# EAGLE design V2 (EAGLE 9.6.2)
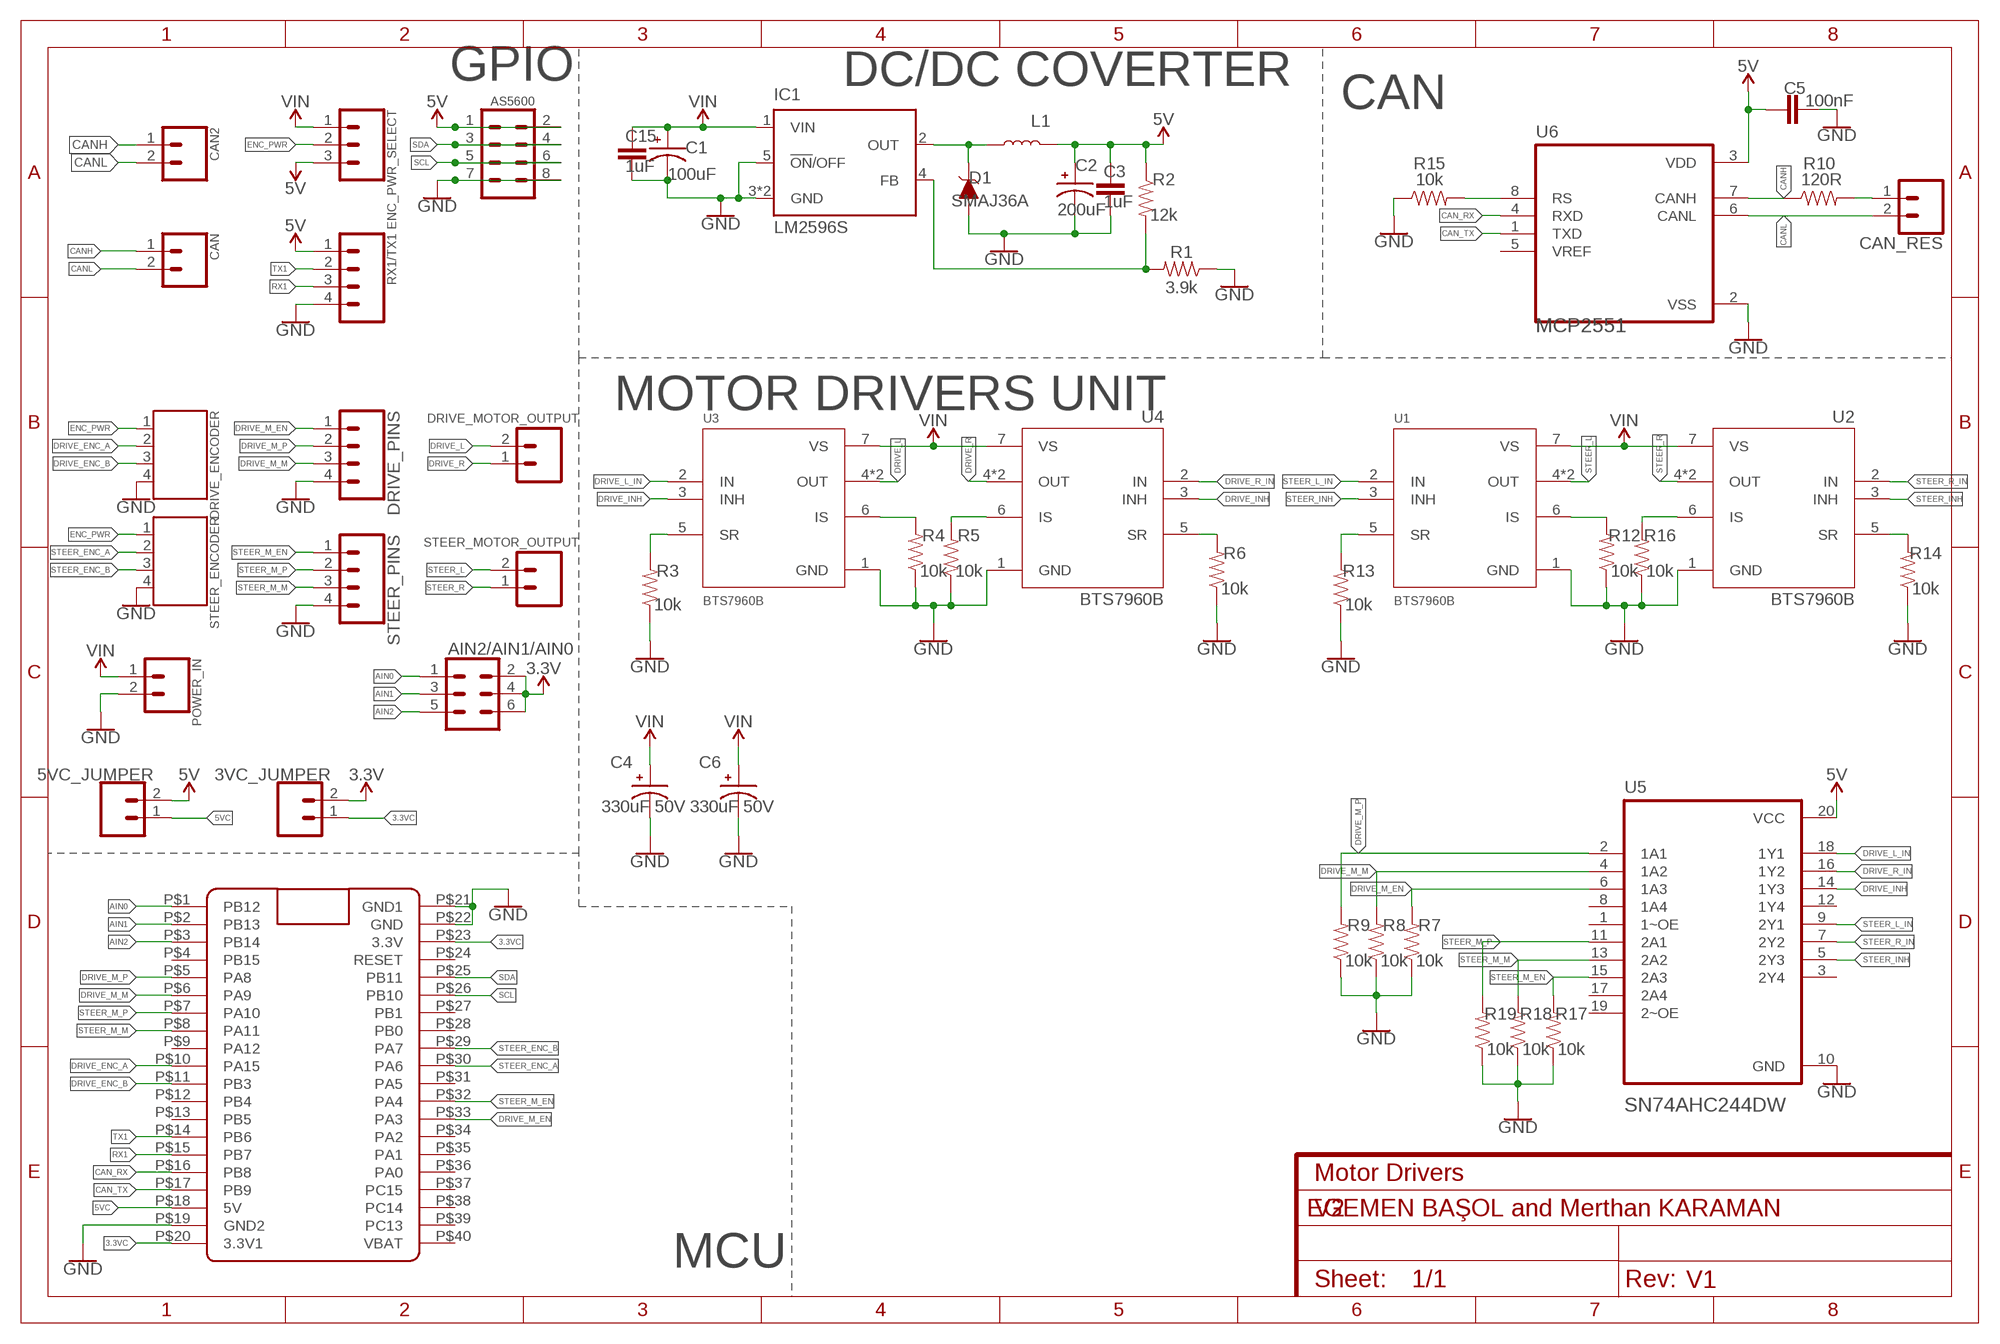
[diagram p0: schematic, sheet 1]
FRAME1 (FRAME-A4L): CNAME: Motor Drivers; CREVISION: V1; DESIGNER: EGEMEN BAŞOL and Merthan KARAMAN; REV: V2

## Parts
3VC_JUMPER  CONN_02  [1X02]
5VC_JUMPER  CONN_02  [1X02]
AIN2/AIN1/AIN0  CONN_03X2FEMALE  [2X3]
AS5600  5V/SCL/SDA/GND  CONN_04X2  [2X4]
C1  100uF  CPOL-SMD  [CPOL-SMD]
C2  200uF  CPOL-SMD  [CPOL-SMD]
C3  1uF  0.18UF-0603-10V-10%  [0603]
C4  330uF 50V  CPOL-RADIAL-5MM-10MM  [CPOL-RADIAL-5MM-10MM]
C5  100nF  CAP-0805  [0805]
C6  330uF 50V  CPOL-RADIAL-5MM-10MM  [CPOL-RADIAL-5MM-10MM]
C15  1uF  2.2UF-0805-25V-(+80/-20%)  [0805]
CAN  CANH/CANL  5.08MM_2PIN  [5.08MM_2PIN]
CAN2  CANH/CANL  5.08MM_2PIN  [5.08MM_2PIN]
CAN_RES  CONN_02  [1X02]
D1  SMAJ36A  DIODE_TVS_UNI  [DO-214AC]
DRIVE_ENCODER  GND/B/A/PWR  5.08MM_4PIN  [5.08MM_4PIN]
DRIVE_MOTOR_OUTPUT  5.08MM_2PIN  [5.08MM_2PIN]
DRIVE_PINS  EN/ PWM_P/ PWM_M/ GND  CONN_04  [1X04]
ENC_PWR_SELECT  VIN/PWR/5V  CONN_03  [1X03]
IC1  LM2596S  [TO263-5]
L1  47uH  COIL  [COIL_14X14]
POWER_IN  VIN/GND  5.08MM_2PIN  [5.08MM_2PIN]
R1  3.9k  RESISTOR0805  [0805]
R2  12k  RESISTOR0805  [0805]
R3  10k  RESISTOR0805  [0805]
R4  10k  RESISTOR0805  [0805]
R5  10k  RESISTOR0805  [0805]
R6  10k  RESISTOR0805  [0805]
R7  10k  RESISTOR0805  [0805]
R8  10k  RESISTOR0805  [0805]
R9  10k  RESISTOR0805  [0805]
R10  120R  RESISTOR0805  [0805]
R12  10k  RESISTOR0805  [0805]
R13  10k  RESISTOR0805  [0805]
R14  10k  RESISTOR0805  [0805]
R15  10k  RESISTOR0805  [0805]
R16  10k  RESISTOR0805  [0805]
R17  10k  RESISTOR0805  [0805]
R18  10k  RESISTOR0805  [0805]
R19  10k  RESISTOR0805  [0805]
RX1/TX1  GND/RX1/TX1/5V  CONN_04  [1X04]
STEER_ENCODER  PWR/A/B/GND  5.08MM_4PIN  [5.08MM_4PIN]
STEER_MOTOR_OUTPUT  5.08MM_2PIN  [5.08MM_2PIN]
STEER_PINS  EN/ PWM_P/ PWM_M/ GND  CONN_04  [1X04]
U1  BTS7960B  [DPAK127P1490X440-8N]
U2  BTS7960B  [DPAK127P1490X440-8N]
U3  BTS7960B  [DPAK127P1490X440-8N]
U4  BTS7960B  [DPAK127P1490X440-8N]
U5  SN74AHC244DW  [SOIC127P1030X265-20N]
U6  MCP2551  [DIP-8]
U$1  BLUE_PILL  [BLUE_PILL]

## Nets
3.3V: 3VC_JUMPER.2 AIN2/AIN1/AIN0.2 AIN2/AIN1/AIN0.4 AIN2/AIN1/AIN0.6
3.3VC: 3VC_JUMPER.1 U$1.P$20(3.3V1) U$1.P$23(3.3V)
5V: 5VC_JUMPER.2 AS5600.1 AS5600.2 C2.1 C3.2 C5.2 ENC_PWR_SELECT.3 L1.P$2 R2.1 RX1/TX1.1 U5.20(VCC) U6.3(VDD)
5VC: 5VC_JUMPER.1 U$1.P$18(5V)
AIN0: AIN2/AIN1/AIN0.1 U$1.P$1(PB12)
AIN1: AIN2/AIN1/AIN0.3 U$1.P$2(PB13)
AIN2: AIN2/AIN1/AIN0.5 U$1.P$3(PB14)
CAN_RX: U6.4(RXD) U$1.P$16(PB8)
CAN_TX: U6.1(TXD) U$1.P$17(PB9)
CANH: CAN2.1 CAN.1 R10.1 U6.7(CANH)
CANL: CAN2.2 CAN.2 CAN_RES.2 U6.6(CANL)
DRIVE_ENC_A: DRIVE_ENCODER.2 U$1.P$10(PA15)
DRIVE_ENC_B: DRIVE_ENCODER.3 U$1.P$11(PB3)
DRIVE_INH: U3.3(INH) U4.3(INH) U5.14(1Y3)
DRIVE_L: DRIVE_MOTOR_OUTPUT.2 U3.4(OUT) U3.8(OUT)
DRIVE_L_IN: U3.2(IN) U5.18(1Y1)
DRIVE_M_EN: DRIVE_PINS.1 R7.2 U5.6(1A3) U$1.P$33(PA3)
DRIVE_M_M: DRIVE_PINS.3 R8.2 U5.4(1A2) U$1.P$6(PA9)
DRIVE_M_P: DRIVE_PINS.2 R9.2 U5.2(1A1) U$1.P$5(PA8)
DRIVE_R: DRIVE_MOTOR_OUTPUT.1 U4.4(OUT) U4.8(OUT)
DRIVE_R_IN: U4.2(IN) U5.16(1Y2)
ENC_PWR: DRIVE_ENCODER.1 ENC_PWR_SELECT.2 STEER_ENCODER.1
GND: AS5600.7 AS5600.8 C1.2 C2.2 C3.1 C4.N C5.1 C6.N C15.1 D1.A DRIVE_ENCODER.4 DRIVE_PINS.4 IC1.3(GND) IC1.5(!ON!/OFF) IC1.TAB(GND) POWER_IN.2 R1.1 R3.1 R4.1 R5.1 R6.1 R7.1 R8.1 R9.1 R12.1 R13.1 R14.1 R15.1 R16.1 R17.1 R18.1 R19.1 RX1/TX1.4 STEER_ENCODER.4 STEER_PINS.4 U1.1(GND) U2.1(GND) U3.1(GND) U4.1(GND) U5.10(GND) U6.2(VSS) U$1.P$19(GND2) U$1.P$21(GND1) U$1.P$22(GND)
N$1: D1.C IC1.2(OUT) L1.P$1
N$2: IC1.4(FB) R1.2 R2.2
N$3: R14.2 U2.5(SR)
N$4: R16.2 U2.6(IS)
N$5: CAN_RES.1 R10.2
N$6: R6.2 U4.5(SR)
N$7: R5.2 U4.6(IS)
N$8: R4.2 U3.6(IS)
N$9: R3.2 U3.5(SR)
N$11: R12.2 U1.6(IS)
N$12: R13.2 U1.5(SR)
N$13: R15.2 U6.8(RS)
RX1: RX1/TX1.3 U$1.P$15(PB7)
SCL: AS5600.5 AS5600.6 U$1.P$26(PB10)
SDA: AS5600.3 AS5600.4 U$1.P$25(PB11)
STEER_ENC_A: STEER_ENCODER.2 U$1.P$30(PA6)
STEER_ENC_B: STEER_ENCODER.3 U$1.P$29(PA7)
STEER_INH: U1.3(INH) U2.3(INH) U5.5(2Y3)
STEER_L: STEER_MOTOR_OUTPUT.2 U1.4(OUT) U1.8(OUT)
STEER_L_IN: U1.2(IN) U5.9(2Y1)
STEER_M_EN: R17.2 STEER_PINS.1 U5.15(2A3) U$1.P$32(PA4)
STEER_M_M: R18.2 STEER_PINS.3 U5.13(2A2) U$1.P$8(PA11)
STEER_M_P: R19.2 STEER_PINS.2 U5.11(2A1) U$1.P$7(PA10)
STEER_R: STEER_MOTOR_OUTPUT.1 U2.4(OUT) U2.8(OUT)
STEER_R_IN: U2.2(IN) U5.7(2Y2)
TX1: RX1/TX1.2 U$1.P$14(PB6)
VIN: C1.1 C4.P C6.P C15.2 ENC_PWR_SELECT.1 IC1.1(VIN) POWER_IN.1 U1.7(VS) U2.7(VS) U3.7(VS) U4.7(VS)
Unconnected: U5.1(1~OE) U5.3(2Y4) U5.8(1A4) U5.12(1Y4) U5.17(2A4) U5.19(2~OE) U6.5(VREF) U$1.P$4(PB15) U$1.P$9(PA12) U$1.P$12(PB4) U$1.P$13(PB5) U$1.P$24(RESET) U$1.P$27(PB1) U$1.P$28(PB0) U$1.P$31(PA5) U$1.P$34(PA2) U$1.P$35(PA1) U$1.P$36(PA0) U$1.P$37(PC15) U$1.P$38(PC14) U$1.P$39(PC13) U$1.P$40(VBAT)

## Notes on the sheet
- GPIO | DC/DC COVERTER
- CAN
- MOTOR DRIVERS UNIT
- MCU

## Library data of the parts
3VC_JUMPER 5VC_JUMPER CAN_RES = SparkFun-Connectors:CONN_02: Multi connection point. Often used as Generic Header-pin footprint for 0.1 inch spaced/style header connections On any of the 0.1 inch spaced packages, you can populate with these: Break Away Headers - Straight <https://www.sparkfun.com/products/116> (PRT-00116) Break Away Male Headers - Right Angle <https://www.sparkfun.com/products/553> (PRT-00553) Female Headers <https://www.sparkfun.com/products/115> (PRT-00115) Break Away Headers - Machine Pin <https://www.sparkfun.com/products/117> (PRT-00117) Break Away Female Headers - Swiss Machine Pin <https://www.sparkfun.com/products/743> (PRT-00743) For SCREWTERMINALS and SPRING TERMINALS visit here: Screw Terimnals on SparkFun.com <https://www.sparkfun.com/search/results?term=Screw+Terminals> (5mm/3.5mm/2.54mm spacing) This device is also useful as a general connection point to wire up your design to another part of your project. Our various solder wires solder well into these plated through hole pads. Hook-Up Wire - Assortment (Stranded, 22 AWG) <https://www.sparkfun.com/products/11375> (PRT-11375) Hook-Up Wire - Assortment (Solid Core, 22 AWG) <https://www.sparkfun.com/products/11367> (PRT-11367) View the entire wire category on our website here <https://www.sparkfun.com/categories/141> Special notes: Molex polarized connector foot print use with: PRT-08233 with associated crimp pins and housings. 2.54_SCREWTERM for use with PRT-10571. 3.5mm Screw Terminal footprints for PRT-08084 5mm Screw Terminal footprints for use with PRT-08432
AIN2/AIN1/AIN0 = SparkFun-Connectors:CONN_03X2: Multi connection point. Often used as Generic Header-pin footprint for 0.1 inch spaced/style header connections You can populate with any combo of single row headers, but if you'd like an exact match, check these: Header - 2x3 (Male, 0.1") <https://www.sparkfun.com/products/12807> (PRT-12807) Header - 2x3 (Female, 0.1") <https://www.sparkfun.com/products/13010> (PRT-13010) 2x3 Pin Shrouded Header <https://www.sparkfun.com/products/10877> (PRT-10877) On any of the 0.1 inch spaced packages, you can populate with these: Break Away Headers - Straight <https://www.sparkfun.com/products/116> (PRT-00116) Break Away Male Headers - Right Angle <https://www.sparkfun.com/products/553> (PRT-00553) Female Headers <https://www.sparkfun.com/products/115> (PRT-00115) Break Away Headers - Machine Pin <https://www.sparkfun.com/products/117> (PRT-00117) Break Away Female Headers - Swiss Machine Pin <https://www.sparkfun.com/products/743> (PRT-00743) Special note: the shrouded connector mates well with our 3x2 ribbon cables: Ribbon Crimp Connector - 6-pin (2x3, Female) <https://www.sparkfun.com/products/10651> (PRT-10651) Ribbon Cable - 6 wire (15ft) <https://www.sparkfun.com/products/10646> (PRT-10646); PROD_ID: CONN-11566; VALUE: FEMALE 2x3
AS5600 = SparkFun-Connectors:CONN_04X2: Multi connection point. Often used as Generic Header-pin footprint for 0.1 inch spaced/style header connections On any of the 0.1 inch spaced packages, you can populate with these: Break Away Headers - Straight <https://www.sparkfun.com/products/116> (PRT-00116) Break Away Male Headers - Right Angle <https://www.sparkfun.com/products/553> (PRT-00553) Female Headers <https://www.sparkfun.com/products/115> (PRT-00115) Break Away Headers - Machine Pin <https://www.sparkfun.com/products/117> (PRT-00117) Break Away Female Headers - Swiss Machine Pin <https://www.sparkfun.com/products/743> (PRT-00743)
C1 C2 = El_yapimi:CPOL-SMD: Check availability <https://pricing.snapeda.com/parts/EEEFN1H101L/Panasonic/view-part?ref=eda>; AVAILABILITY: In Stock; DESCRIPTION: CAP ALUM 100UF 20% 50V SMD; MF: Panasonic; MP: EEEFN1H101L; PACKAGE: RADIAL-2 Panasonic; PRICE: None; PURCHASE-URL: https://pricing.snapeda.com/search/part/EEEFN1H101L/?ref=eda
C3 = SparkFun-Capacitors:0.18UF: 0.18µF ceramic capacitor A capacitor is a passive two-terminal electrical component used to store electrical energy temporarily in an electric field.; PROD_ID: CAP-12380; VALUE: 0.18uF
C4 C6 = El_yapimi:CPOL-RADIAL-5MM-10MM: M-A Check availability <https://pricing.snapeda.com/parts/ECA2VM4R7/Panasonic/view-part?ref=eda>; AVAILABILITY: In Stock; DESCRIPTION: Aluminium Electrolytic Capacitor, Aec-Q200 M Series, 4.7 - F, - 20%, 350 V, 10 Mm; MF: Panasonic; MP: ECA2VM4R7; PACKAGE: RADIAL-2 Panasonic; PRICE: None; PURCHASE-URL: https://pricing.snapeda.com/search/part/ECA2VM4R7/?ref=eda
C5 = SparkFun-Capacitors:CAP
C15 = SparkFun-Capacitors:2.2UF: 2.2µF ceramic capacitors A capacitor is a passive two-terminal electrical component used to store electrical energy temporarily in an electric field.; PROD_ID: CAP-11624; VALUE: 2.2uF
CAN CAN2 DRIVE_MOTOR_OUTPUT POWER_IN STEER_MOTOR_OUTPUT = El_yapimi:5.08MM_2PIN
D1 = SparkFun-DiscreteSemi:DIODE_TVS_UNI; PROD_ID: DIO-15812
DRIVE_ENCODER STEER_ENCODER = El_yapimi:5.08MM_4PIN: Check availability <https://pricing.snapeda.com/parts/TB006-508-04BE/CUI%20Devices/view-part?ref=eda>; AVAILABILITY: In Stock; CUI_PURCHASE_URL: https://www.cuidevices.com/product/interconnect/connectors/terminal-blocks/tb006-508-series?utm_source=snapeda.com&utm_medium=referral&utm_campaign=snapedaBOM; DESCRIPTION: 2~24 Poles, Screw Type, Horizontal, 5.08 Pitch, 26~14 (AWG), Terminal Block Connector; MF: CUI Devices; MP: TB006-508-04BE; PACKAGE: None; PRICE: None; PURCHASE-URL: https://pricing.snapeda.com/search/part/TB006-508-04BE/?ref=eda
DRIVE_PINS RX1/TX1 STEER_PINS = SparkFun-Connectors:CONN_04: Multi connection point. Often used as Generic Header-pin footprint for 0.1 inch spaced/style header connections On any of the 0.1 inch spaced packages, you can populate with these: Break Away Headers - Straight <https://www.sparkfun.com/products/116> (PRT-00116) Break Away Male Headers - Right Angle <https://www.sparkfun.com/products/553> (PRT-00553) Female Headers <https://www.sparkfun.com/products/115> (PRT-00115) Break Away Headers - Machine Pin <https://www.sparkfun.com/products/117> (PRT-00117) Break Away Female Headers - Swiss Machine Pin <https://www.sparkfun.com/products/743> (PRT-00743) For SCREWTERMINALS and SPRING TERMINALS visit here: Screw Terimnals on SparkFun.com <https://www.sparkfun.com/search/results?term=Screw+Terminals> (5mm/3.5mm/2.54mm spacing) This device is also useful as a general connection point to wire up your design to another part of your project. Our various solder wires solder well into these plated through hole pads. Hook-Up Wire - Assortment (Stranded, 22 AWG) <https://www.sparkfun.com/products/11375> (PRT-11375) Hook-Up Wire - Assortment (Solid Core, 22 AWG) <https://www.sparkfun.com/products/11367> (PRT-11367) View the entire wire category on our website here <https://www.sparkfun.com/categories/141> Special notes: Molex polarized connector foot print use with SKU : PRT-08231 with associated crimp pins and housings. 1MM SMD Version SKU: PRT-10208; PROD_ID: CONN-09696
ENC_PWR_SELECT = SparkFun-Connectors:CONN_03: Multi connection point. Often used as Generic Header-pin footprint for 0.1 inch spaced/style header connections On any of the 0.1 inch spaced packages, you can populate with these: Break Away Headers - Straight <https://www.sparkfun.com/products/116> (PRT-00116) Break Away Male Headers - Right Angle <https://www.sparkfun.com/products/553> (PRT-00553) Female Headers <https://www.sparkfun.com/products/115> (PRT-00115) Break Away Headers - Machine Pin <https://www.sparkfun.com/products/117> (PRT-00117) Break Away Female Headers - Swiss Machine Pin <https://www.sparkfun.com/products/743> (PRT-00743) Stackable Header - 3 Pin (Female, 0.1") <https://www.sparkfun.com/products/13875> (PRT-13875) For SCREWTERMINALS and SPRING TERMINALS visit here: Screw Terimnals on SparkFun.com <https://www.sparkfun.com/search/results?term=Screw+Terminals> (5mm/3.5mm/2.54mm spacing) This device is also useful as a general connection point to wire up your design to another part of your project. Our various solder wires solder well into these plated through hole pads. Hook-Up Wire - Assortment (Stranded, 22 AWG) <https://www.sparkfun.com/products/11375> (PRT-11375) Hook-Up Wire - Assortment (Solid Core, 22 AWG) <https://www.sparkfun.com/products/11367> (PRT-11367) View the entire wire category on our website here <https://www.sparkfun.com/categories/141> Special notes: Molex polarized connector foot print use with SKU : PRT-08232 with associated crimp pins and housings.
IC1 = El_yapimi:LM2596S
L1 = El_yapimi:COIL
R1-R10 R12-R19 = SparkFun-Resistors:RESISTOR: Generic Resistor Package
U1-U4 = El_yapimi:BTS7960B: Half Bridge Motor Driver 7-Pin(6+Tab) TO-263 Check availability <https://pricing.snapeda.com/parts/BTS7960B/Infineon/view-part?ref=eda>
U5 = El_yapimi:SN74AHC244DW: Check availability <https://pricing.snapeda.com/parts/SN74AHC244DW/Texas%20Instruments/view-part?ref=eda>; AVAILABILITY: In Stock; DESCRIPTION: 8-ch, 2-V to 5.5-V buffers with 3-state outputs; MF: Texas Instruments; MP: SN74AHC244DW; PACKAGE: SOIC-20 Texas Instruments; PRICE: None; PURCHASE-URL: https://pricing.snapeda.com/search/part/SN74AHC244DW/?ref=eda
U6 = El_yapimi:MCP2551: Check availability <https://pricing.snapeda.com/parts/MCP2551-E/P/Microchip/view-part?ref=eda>; AVAILABILITY: In Stock; DESCRIPTION: 1/1 Transceiver Half CANbus 8-PDIP; MF: Microchip; MP: MCP2551-E/P; PACKAGE: DIP-8 Microchip; PRICE: None; PURCHASE-URL: https://pricing.snapeda.com/search/part/MCP2551-E/P/?ref=eda
U$1 = El_yapimi:BLUE_PILL

## Board
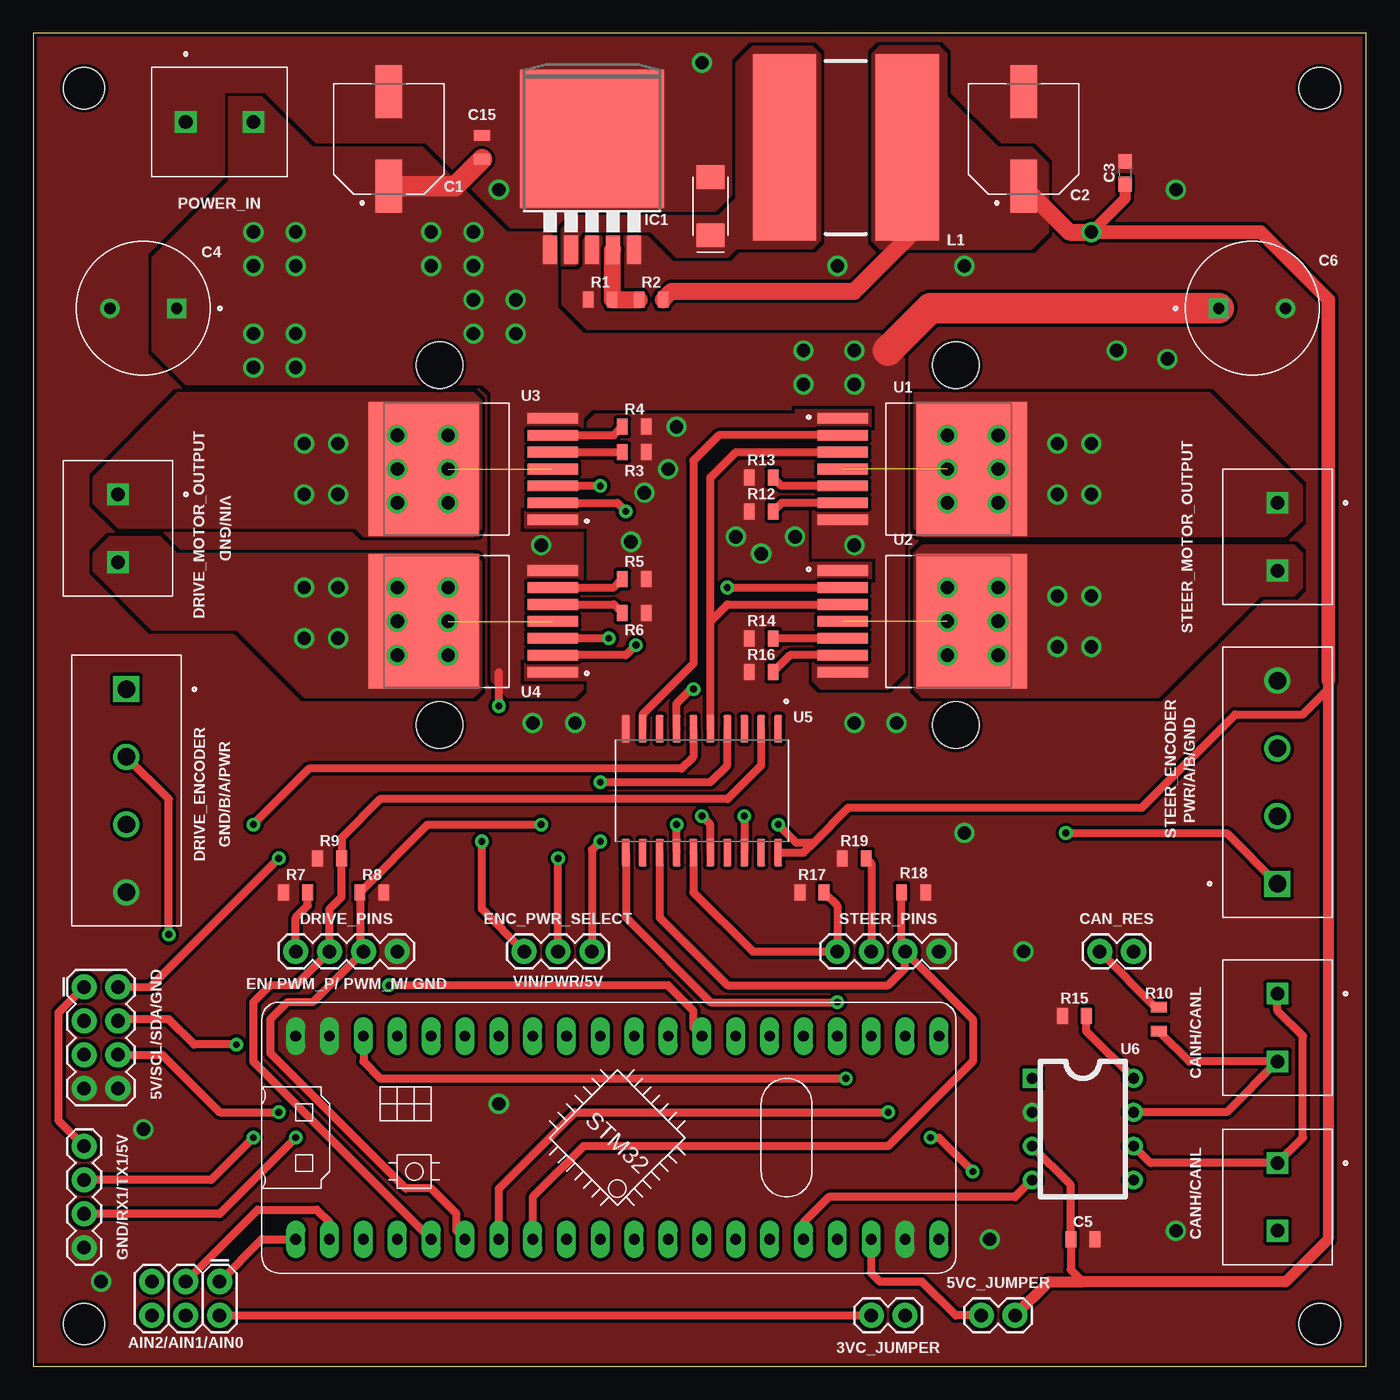
[diagram p1: board, top side]
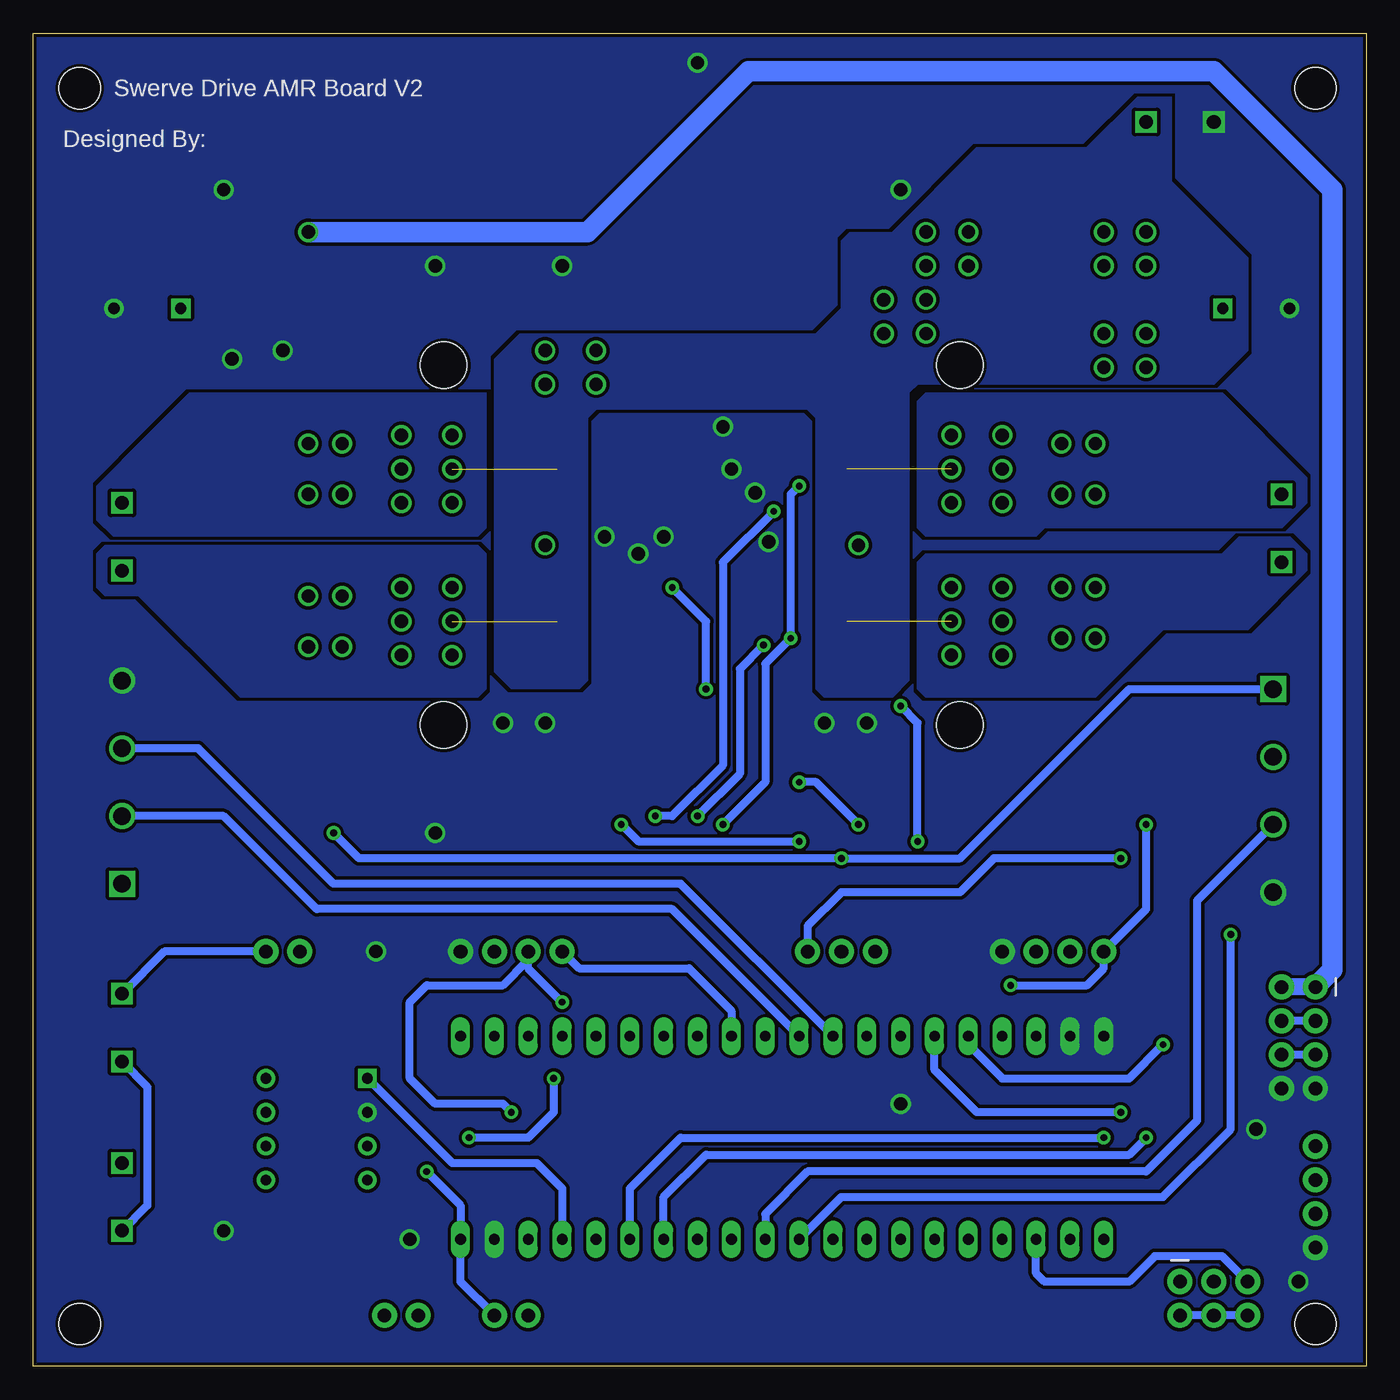
[diagram p2: board, bottom side, seen from below]

Size 100 x 100 mm. Coordinates in mm from the lower left corner, seen from the top.
Outline: 0,100 0,0 100,0 100,100 0,100
Copper layers (1*16): Top 0.035mm / dielectric 1.5mm / Bottom 0.035mm
Design rules "power_standarts *": minimum track width 8mil, minimum drill 20mil, track to track 10mil, track to pad 8mil, pad to pad 8mil, via to via 8mil, smd to smd 8mil, copper to edge 10mil, drill to drill 8mil, minimum pad ring 12mil, minimum via ring 10mil, stop-mask expansion 4mil, vias tented up to drill 25mil, thermal gap 10mil
Holes 3.1 mm at 3.81,95.89 96.52,95.89 96.52,3.17 3.81,3.17

### Footprints (pad centres in the part's own frame; a part is rotated, then mirrored left to right if it is on the bottom)
1X02 = drill 1.016 pad 1.88: 1 0,0; 2 2.54,0
2X3 = drill 1.016 pad 1.88: 1 0,0; 2 0,2.54; 3 2.54,0; 4 2.54,2.54; 5 5.08,0; 6 5.08,2.54
2X4 = drill 1.016 pad 1.88: 1 -3.81,-1.27; 2 -3.81,1.27; 3 -1.27,-1.27; 4 -1.27,1.27; 5 1.27,-1.27; 6 1.27,1.27; 7 3.81,-1.27; 8 3.81,1.27
CPOL-SMD = smd 4 x 2: 1 -3.55,0; 2 3.55,0
0603 = smd 1.1 x 1: 1 -0.85,0; 2 0.85,0
CPOL-RADIAL-5MM-10MM = drill 0.85 pad 1.2: N 2.5,0 | drill 0.85 pad 1.2 square: P -2.5,0
0805 = smd 0.8 x 1.2: 1 -0.9,0; 2 0.9,0
5.08MM_2PIN = drill 1.016 square: 1 5.08,0; 2 0,0
DO-214AC = smd 1.778 x 2.083: A 2.21,0; C -2.159,0
5.08MM_4PIN = drill 1.3 square: 1 0,0 | drill 1.3: 2 5.08,0; 3 10.16,0; 4 15.24,0
1X04 = drill 1.016 pad 1.88: 1 0,0; 2 2.54,0; 3 5.08,0; 4 7.62,0
1X03 = drill 1.016 pad 1.88: 1 0,0; 2 2.54,0; 3 5.08,0
TO263-5 = smd 1.067 x 2.159: 1 -3.15,-8.331; 2 -1.575,-8.331; 3 0,-8.331; 4 1.575,-8.331; 5 3.15,-8.331 | smd 10.8 x 10.41: TAB 0,0
COIL_14X14 = smd 14 x 4.75: P$1 0,4.6; P$2 0,-4.6
DPAK127P1490X440-8N = smd 3.81 x 0.8: 1 -5.95,3.81; 2 -5.95,2.54; 3 -5.95,1.27; 4 -5.95,0; 5 -5.95,-1.27; 6 -5.95,-2.54; 7 -5.95,-3.81 | smd 8.29 x 10.07: 8 3.71,0
SOIC127P1030X265-20N = smd 2.06 x 0.6: 1 -4.64,5.715; 2 -4.64,4.445; 3 -4.64,3.175; 4 -4.64,1.905; 5 -4.64,0.635; 6 -4.64,-0.635; 7 -4.64,-1.905; 8 -4.64,-3.175; 9 -4.64,-4.445; 10 -4.64,-5.715; 11 4.64,-5.715; 12 4.64,-4.445; 13 4.64,-3.175; 14 4.64,-1.905; 15 4.64,-0.635; 16 4.64,0.635; 17 4.64,1.905; 18 4.64,3.175; 19 4.64,4.445; 20 4.64,5.715
DIP-8 = drill 0.8 square: 1 -3.81,3.81 | drill 0.8: 2 -3.81,1.27; 3 -3.81,-1.27; 4 -3.81,-3.81; 5 3.81,-3.81; 6 3.81,-1.27; 7 3.81,1.27; 8 3.81,3.81
BLUE_PILL = drill 0.8 long: P$1 -7.62,15.24; P$2 -7.62,12.7; P$3 -7.62,10.16; P$4 -7.62,7.62; P$5 -7.62,5.08; P$6 -7.62,2.54; P$7 -7.62,0; P$8 -7.62,-2.54; P$9 -7.62,-5.08; P$10 -7.62,-7.62; P$11 -7.62,-10.16; P$12 -7.62,-12.7; P$13 -7.62,-15.24; P$14 -7.62,-17.78; P$15 -7.62,-20.32; P$16 -7.62,-22.86; P$17 -7.62,-25.4; P$18 -7.62,-27.94; P$19 -7.62,-30.48; P$20 -7.62,-33.02; P$21 7.62,15.24; P$22 7.62,12.7; P$23 7.62,10.16; P$24 7.62,7.62; P$25 7.62,5.08; P$26 7.62,2.54; P$27 7.62,0; P$28 7.62,-2.54; P$29 7.62,-5.08; P$30 7.62,-7.62; P$31 7.62,-10.16; P$32 7.62,-12.7; P$33 7.62,-15.24; P$34 7.62,-17.78; P$35 7.62,-20.32; P$36 7.62,-22.86; P$37 7.62,-25.4; P$38 7.62,-27.94; P$39 7.62,-30.48; P$40 7.62,-33.02
BTS_HEATER = hole 3.5: -13.5,0; 13.5,0

### Placement (x,y rotation side)
3VC_JUMPER  65.41,3.81 180 top
5VC_JUMPER  71.12,3.81 0 top
AIN2/AIN1/AIN0  13.97,6.35 180 top
AS5600  5.08,24.64 270 top
C1  26.67,92.08 90 top
C2  74.3,92.08 90 top
C3  81.92,89.53 270 top
C4  8.26,79.38 180 top
C5  78.74,9.53 180 top
C6  91.44,79.38 0 top
C15  33.66,91.44 270 top
CAN  93.34,27.94 270 top
CAN2  93.34,15.24 270 top
CAN_RES  80.01,31.11 0 top
D1  50.8,87 90 top
DRIVE_ENCODER  6.99,50.8 270 top
DRIVE_MOTOR_OUTPUT  6.35,65.41 270 top
DRIVE_PINS  19.68,31.11 0 top
ENC_PWR_SELECT  36.83,31.11 0 top
IC1  41.91,92.08 0 top
L1  60.96,91.44 90 top
POWER_IN  11.43,93.34 0 top
R1  42.55,80.01 0 top
R2  46.35,80.01 180 top
R3  45.09,68.58 180 top
R4  45.09,70.48 180 top
R5  45.09,59.05 180 top
R6  45.09,56.52 180 top
R7  19.68,35.56 0 top
R8  25.4,35.56 180 top
R9  22.23,38.1 0 top
R10  84.45,26.04 90 top
R12  54.61,64.14 0 top
R13  54.61,66.67 0 top
R14  54.61,54.61 0 top
R15  78.11,26.29 0 top
R16  54.61,52.07 0 top
R17  58.42,35.56 0 top
R18  66.04,35.56 180 top
R19  61.59,38.1 0 top
RX1/TX1  3.81,16.51 270 top
STEER_ENCODER  93.34,36.2 90 top
STEER_MOTOR_OUTPUT  93.34,64.77 270 top
STEER_PINS  60.33,31.11 0 top
U1  66.67,67.31 0 top
U2  66.67,55.88 0 top
U3  33.02,67.31 180 top
U4  33.02,55.88 180 top
U5  50.16,43.18 270 top
U6  78.74,17.78 0 top
U$1  34.92,17.14 90 top
U$2  [BTS_HEATER]  30.48,61.59 90 top
U$3  [BTS_HEATER]  69.22,61.59 90 top

### Tracks (layer width: path | path; a pad name or v marks a point on that pad's centre or on a via)
3.3V
  Top 0.61: AIN2/AIN1/AIN0.2 3VC_JUMPER.2
  Bottom 0.61: AIN2/AIN1/AIN0.6 AIN2/AIN1/AIN0.4 AIN2/AIN1/AIN0.2
3.3VC  (via drill 0.51)
  Top 0.61: U$1.P$23 24.77,22.86 26.04,21.59 v60.96,21.59 | v67.31,17.14 67.94,17.14 v70.48,14.61
  Bottom 0.61: 3VC_JUMPER.1 67.94,6.35 U$1.P$20 67.94,12.06 v70.48,14.61 | v60.96,21.59 60.96,19.05 62.87,17.14 v67.31,17.14
5V  (via drill 0.51, 1)
  Top 0.61: U6.3 77.84,13.6 C5.2 77.84,7.25 78.74,6.35 | 58.52,39.27 61.16,41.91 83.19,41.91 90.17,48.9 95.25,48.9 97.16,50.8 97.16,51.44 | 58.52,39.27 57.78,38.54 U5.20 | AS5600.2 8.76,28.45 v18.41,38.1 | RX1/TX1.1 1.91,18.41 1.91,26.54 AS5600.1 | 58.52,39.27 57.25,39.27 v55.88,40.64 | v42.55,39.37 41.91,38.73 ENC_PWR_SELECT.3
  Top 0.813: 97.16,51.44 97.16,9.53 93.98,6.35 78.74,6.35 76.2,6.35 5VC_JUMPER.2 | v79.38,85.09 81.92,87.63 C3.2
  Top 1.016: v79.38,85.09 92.08,85.09 97.16,80.01 97.16,51.44
  Top 1.27: R2.1 47.89,80.64 61.59,80.64 65.56,84.61 L1.P$2 | C2.1 77.73,85.09 v79.38,85.09
  Bottom 0.61: ENC_PWR_SELECT.3 41.91,33.02 39.37,35.56 30.48,35.56 27.94,38.1 v18.41,38.1 | v55.88,40.64 54.61,39.37 v42.55,39.37
  Bottom 1.27: AS5600.1 AS5600.2
  Bottom 1.524: v79.38,85.09 58.42,85.09 46.35,97.16 11.43,97.16 2.54,88.27 2.54,29.72 AS5600.1
  pour Top (no thermals): 67.94,99.06 63.5,99.06 62.87,98.42 62.87,84.45 63.5,83.82 74.93,83.82 76.2,85.09 76.2,90.17 74.93,91.44 72.39,91.44 68.58,95.25 68.58,98.42
5VC
  Top 0.61: 5VC_JUMPER.1 69.22,3.81 66.67,6.35 63.5,6.35 62.87,6.99 U$1.P$18
AIN0
  Top 0.61: AIN2/AIN1/AIN0.1 17.14,9.53 U$1.P$1
AIN1
  Top 0.61: U$1.P$2 22.23,10.79 21.27,11.75 16.83,11.75 AIN2/AIN1/AIN0.3
AIN2
  Bottom 0.61: AIN2/AIN1/AIN0.5 10.79,8.26 15.88,8.26 17.78,6.35 24.13,6.35 24.77,6.99 U$1.P$3
CAN_RX
  Top 0.61: U6.4 73.66,12.7 59.69,12.7 57.78,10.79 U$1.P$16
CAN_TX
  Bottom 0.61: U6.1 68.58,15.24 62.23,15.24 60.33,13.34 U$1.P$17
CANH
  Top 0.61: U6.7 89.53,19.05 CAN.1 86.73,22.86 R10.1
  Bottom 0.61: CAN.1 91.44,20.95 91.44,12.06 CAN2.1
CANL
  Top 0.61: U6.6 83.82,15.24 CAN2.2 95.25,17.14 95.25,24.77 93.34,26.67 CAN.2
  Bottom 0.61: CAN_RES.2 90.17,31.11 CAN.2
DRIVE_ENC_A  (via drill 0.51)
  Top 0.61: v10.16,32.38 10.16,42.55 DRIVE_ENCODER.2
  Bottom 0.61: U$1.P$10 39.37,12.7 15.24,12.7 10.16,17.78 v10.16,32.38
DRIVE_ENC_B
  Bottom 0.61: DRIVE_ENCODER.3 12.7,34.92 12.7,18.41 16.51,14.61 41.91,14.61 45.09,11.43 U$1.P$11
DRIVE_INH  (via drill 0.51)
  Top 0.61: U5.14 v48.26,40.64 | v43.18,54.61 U4.3 | v42.55,66.04 U3.3
  Bottom 0.61: v48.26,40.64 45.09,43.81 45.09,52.7 v43.18,54.61 43.18,65.41 v42.55,66.04
DRIVE_L  (via drill 1)  (1 unrouted)
  other vias: 20.32,69.22 22.86,69.22 27.3,64.77 27.3,67.31 27.3,69.85 31.11,69.85 31.11,67.31 20.32,65.41 22.86,65.41 31.11,64.77
  pour Top (no thermals): 24.77,62.23 33.02,62.23 33.66,62.87 33.66,72.39 33.02,73.03 10.79,73.03 4.45,66.67 4.45,64.77 6.35,62.87 24.13,62.87
DRIVE_L1
  pour Bottom (no thermals): 24.77,62.23 33.02,62.23 33.66,62.87 33.66,72.39 33.02,73.03 10.79,73.03 4.45,66.67 4.45,64.77 6.35,62.87 24.13,62.87
DRIVE_L_IN  (via drill 0.51)
  Top 0.61: v53.34,41.27 U5.18 | U3.2 43.81,64.77 v44.45,64.14
  Bottom 0.61: v44.45,64.14 48.26,60.33 48.26,45.09 52.07,41.27 v53.34,41.27
DRIVE_M_EN  (via drill 0.51)
  Top 0.61: DRIVE_PINS.1 19.68,33.66 20.59,34.55 R7.2 | U5.6 49.53,45.72 48.64,44.83 20.7,44.83 v16.51,40.64 | U$1.P$33 49.53,25.4 49.53,26.67 47.62,28.57 v26.67,28.57
  Bottom 0.61: v16.51,40.64 16.51,34.29 DRIVE_PINS.1 19.68,29.84 20.95,28.57 v26.67,28.57
DRIVE_M_M  (via drill 0.51)
  Top 0.61: v38.1,40.64 29.58,40.64 R8.2 24.5,31.38 DRIVE_PINS.3 20.95,27.3 19.05,27.3 17.78,26.04 17.78,23.5 27.94,13.34 29.84,13.34 31.75,11.43 31.75,10.16 U$1.P$6 | v42.55,43.81 50.8,43.81 52.07,45.09 U5.4
  Bottom 0.61: v38.1,40.64 41.27,43.81 v42.55,43.81
DRIVE_M_P
  Top 0.61: U5.2 54.61,45.09 52.07,42.55 26.04,42.55 23.12,39.63 R9.2 23.12,35.19 22.23,34.29 DRIVE_PINS.2 19.68,28.57 17.78,28.57 16.51,27.3 16.51,22.86 U$1.P$5
DRIVE_R  (via drill 1)  (1 unrouted)
  other vias: 20.32,58.42 22.86,58.42 27.3,53.34 27.3,55.88 20.32,54.61 22.86,54.61 31.11,53.34 31.11,55.88 27.3,58.42 31.11,58.42
  pour Top (no thermals): 33.02,50.16 33.66,50.8 33.66,60.33 33.02,60.96 10.79,60.96 9.53,62.23 5.71,62.23 4.45,60.96 4.45,59.69 8.89,55.24 15.24,55.24 20.32,50.16
DRIVE_R1
  pour Bottom (no thermals): 33.02,50.16 33.66,50.8 33.66,60.33 33.02,60.96 10.79,60.96 9.53,62.23 5.71,62.23 4.45,60.96 4.45,59.69 8.89,55.24 15.24,55.24 20.32,50.16
DRIVE_R_IN  (via drill 0.51)
  Top 0.61: U5.16 50.8,40.64 v50.16,41.27 | v45.21,54.1 44.45,53.34 U4.2
  Bottom 0.61: v50.16,41.27 46.99,44.45 46.99,52.32 v45.21,54.1
ENC_PWR  (via drill 0.51)
  Top 0.61: ENC_PWR_SELECT.2 v39.37,38.1 | v77.47,40.01 89.53,40.01 STEER_ENCODER.1
  Bottom 0.61: DRIVE_ENCODER.1 17.78,50.8 30.48,38.1 v39.37,38.1 75.56,38.1 v77.47,40.01
GND  (via drill 1)
  other vias: 44.83,61.85 45.85,65.53 52.7,62.23 57.15,62.23 48.26,70.48 61.59,48.26 64.77,48.26 37.47,48.26 40.64,48.26 69.85,40.01 34.92,19.68 71.75,9.53 85.72,10.16 5.08,6.35 8.26,17.78 50.16,97.79 34.92,88.27 60.33,82.55 69.85,82.55 85.72,88.27 54.61,60.96 47.62,67.31 81.28,76.2 85.09,75.56 74.3,31.11
  pour Top (rank 4, no thermals): -1.27,-1.27 100.97,-1.27 100.97,100.97 -1.27,100.97
  pour Bottom (rank 4, no thermals): -2.54,-2.54 102.23,-2.54 102.23,102.23 -2.54,102.23
  pour Top (no thermals): 36.83,52.7 36.83,51.44 42.55,51.44 42.55,52.7
  pour Top (no thermals): 62.87,59.05 57.15,59.05 57.15,60.33 62.87,60.33
  pour Top (no thermals): 62.87,70.48 62.87,71.75 57.15,71.75 57.15,70.48
  pour Top (no thermals): 36.83,64.14 36.83,62.87 41.91,62.87 41.91,64.14
N$1
  pour Top (no thermals): 39.62,82.55 39.62,85.34 40.01,85.72 40.64,86.36 51.44,86.36 52.7,87.63 52.7,97.79 53.98,99.06 57.78,99.06 58.42,99.06 59.05,98.42 59.05,84.45 58.42,83.82 52.7,83.82 52.07,83.19 48.26,83.19 46.35,85.09 41.27,85.09 40.89,84.71 40.89,84.58 40.89,82.8 40.64,82.55
N$2
  Top 1.27: R2.2 R1.2 43.45,83.7 IC1.4
N$3
  Top 0.61: U2.5 R14.2
N$4
  Top 0.61: R16.2 56.78,53.34 U2.6
N$5
  Top 0.61: R10.2 84.19,26.93 CAN_RES.1
N$6
  Top 0.61: R6.2 43.55,57.15 U4.5
N$7
  Top 0.61: R5.2 43.55,58.42 U4.6
N$8
  Top 0.61: R4.2 43.55,69.85 U3.6
N$9
  Top 0.61: U3.5 R3.2
N$11
  Top 0.61: R12.2 56.15,64.77 U1.6
N$12
  Top 0.61: R13.2 56.15,66.04 U1.5
N$13
  Top 0.61: U6.8 79,25.14 R15.2
RX1  (via drill 0.51)
  Top 0.61: v19.68,17.14 13.97,11.43 RX1/TX1.3
  Bottom 0.61: U$1.P$15 55.24,13.34 51.44,17.14 v19.68,17.14
SCL  (via drill 0.51)
  Top 0.61: AS5600.6 9.65,23.37 13.97,19.05 v18.41,19.05
  Bottom 0.61: v18.41,19.05 29.21,19.05 32.38,22.23 U$1.P$26 | AS5600.5 AS5600.6
SDA  (via drill 0.51)
  Top 0.61: v15.24,24.13 12.06,24.13 10.16,26.04 6.48,26.04 AS5600.4
  Bottom 0.61: U$1.P$25 29.84,24.13 27.3,21.59 17.78,21.59 v15.24,24.13 | AS5600.3 AS5600.4
STEER_ENC_A
  Bottom 0.61: U$1.P$30 52.07,34.29 78.74,34.29 85.72,41.27 STEER_ENCODER.2
STEER_ENC_B
  Bottom 0.61: U$1.P$29 51.44,36.2 77.47,36.2 87.63,46.35 STEER_ENCODER.3
STEER_INH
  Top 0.61: U5.5 50.8,55.88 | 50.8,55.88 52.07,57.15 U2.3 | 50.8,55.88 50.8,66.67 52.7,68.58 U1.3
STEER_L  (via drill 1)  (1 unrouted)
  other vias: 68.58,64.77 68.58,67.31 68.58,69.85 76.83,69.22 79.38,69.22 79.38,65.41 76.83,65.41 72.39,64.77 72.39,67.31 72.39,69.85
  pour Top (no thermals): 66.04,73.03 66.04,62.87 66.67,62.23 93.98,62.23 95.25,63.5 95.25,65.41 95.25,66.04 91.44,69.85 88.27,73.03
STEER_L1
  pour Bottom (no thermals): 66.04,73.03 66.04,62.87 66.67,62.23 93.98,62.23 95.25,63.5 95.25,65.41 95.25,66.04 91.44,69.85 88.27,73.03
STEER_L_IN
  Top 0.61: U5.9 45.72,48.9 49.53,52.7 49.53,67.94 51.44,69.85 U1.2
STEER_M_EN
  Top 0.61: R17.2 60.33,34.55 STEER_PINS.1 53.98,31.11 49.53,35.56 U5.15
  Bottom 0.61: STEER_PINS.1 59.05,29.84 50.8,29.84 47.62,26.67 U$1.P$32
STEER_M_M
  Top 0.61: STEER_PINS.3 70.48,26.04 70.48,22.86 64.14,16.51 41.27,16.51 37.47,12.7 U$1.P$8 | STEER_PINS.3 65.14,31.38 R18.2 | U5.13 46.99,33.66 52.07,28.57 64.14,28.57 65.41,29.84 STEER_PINS.3
STEER_M_P  (via drill 0.51)
  Top 0.61: U$1.P$7 34.92,13.34 40.64,19.05 v64.14,19.05 | R19.2 62.87,37.73 STEER_PINS.2 | v60.33,27.3 50.8,27.3 44.45,33.66 U5.11
  Bottom 0.61: v64.14,19.05 64.77,19.68 69.85,19.68 71.75,21.59 71.75,27.3 70.48,28.57 64.77,28.57 62.87,30.48 STEER_PINS.2 62.87,29.84 v60.33,27.3
STEER_R  (via drill 1)  (1 unrouted)
  other vias: 68.58,53.34 68.58,55.88 68.58,58.42 76.83,57.78 79.38,57.78 79.38,53.98 76.83,53.98 72.39,53.34 72.39,55.88 72.39,58.42
  pour Top (no thermals): 94.61,61.59 66.67,61.59 66.04,60.96 66.04,50.8 66.67,50.16 84.45,50.16 92.08,57.78 94.61,57.78 95.25,58.42 95.25,60.96
STEER_R1
  pour Bottom (no thermals): 94.61,61.59 66.67,61.59 66.04,60.96 66.04,50.8 66.67,50.16 84.45,50.16 92.08,57.78 94.61,57.78 95.25,58.42 95.25,60.96
STEER_R_IN  (via drill 0.51)
  Top 0.61: U5.7 48.26,49.73 49.34,50.8 v49.53,50.8 | v52.07,58.42 U2.2
  Bottom 0.61: v52.07,58.42 49.53,55.88 v49.53,50.8
TX1  (via drill 0.51)
  Top 0.61: v16.51,17.14 13.34,13.97 RX1/TX1.2
  Bottom 0.61: U$1.P$14 52.7,12.7 49.53,15.88 17.78,15.88 v16.51,17.14
VIN  (via drill 0.51, 1)
  Top 0.61: ENC_PWR_SELECT.1 33.66,34.29 v33.66,39.37 | v34.92,49.53 34.92,52.07
  Top 1.524: C1.1 31.64,88.53 C15.2
  Top 2.286: 64.14,76.2 67.31,79.38 C6.P
  Bottom 0.61: v33.66,39.37 33.66,48.26 v34.92,49.53
  other vias: 16.51,85.09 19.68,85.09 16.51,82.55 19.68,82.55 61.59,76.2 57.78,76.2 61.59,73.66 57.78,73.66 38.1,61.59 61.59,61.59 29.84,85.09 33.02,85.09 29.84,82.55 33.02,82.55 16.51,77.47 19.68,77.47 16.51,74.93 19.68,74.93 33.02,80.01 36.2,80.01 33.02,77.47 36.2,77.47
  pour Top (rank 2, no thermals): 14.61,95.25 14.61,88.9 8.89,83.19 8.89,76.2 11.43,73.66 33.66,73.66 34.29,73.03 34.29,51.44 35.56,50.16 40.64,50.16 41.27,50.8 41.27,71.12 41.91,71.75 57.78,71.75 58.42,71.12 58.42,51.44 59.05,50.8 64.14,50.8 65.41,52.07 65.41,75.56 63.5,77.47 41.27,77.47 39.37,79.38 39.37,84.45 38.73,85.09 35.56,85.09 29.21,91.44 20.95,91.44 17.14,95.25
VIN1
  pour Bottom (rank 2, no thermals): 14.61,95.25 14.61,88.9 8.89,83.19 8.89,76.2 11.43,73.66 33.66,73.66 34.29,73.03 34.29,51.44 35.56,50.16 40.64,50.16 41.27,50.8 41.27,71.12 41.91,71.75 57.78,71.75 58.42,71.12 58.42,51.44 59.05,50.8 64.14,50.8 65.41,52.07 65.41,75.56 63.5,77.47 41.27,77.47 39.37,79.38 39.37,84.45 38.73,85.09 35.56,85.09 29.21,91.44 20.95,91.44 17.14,95.25

### Text on the board
tNames: VIN/GND
bNames: Swerve Drive AMR Board V2 | Designed By:
tStop: Egemen BAŞOL | Merthan KARAMAN
bStop: Merthan KARAMAN | Egemen BAŞOL